# Altium schematic sheet HV_Measurements.SchDoc
size A4; SheetNumber: 3; SheetTotal: 3
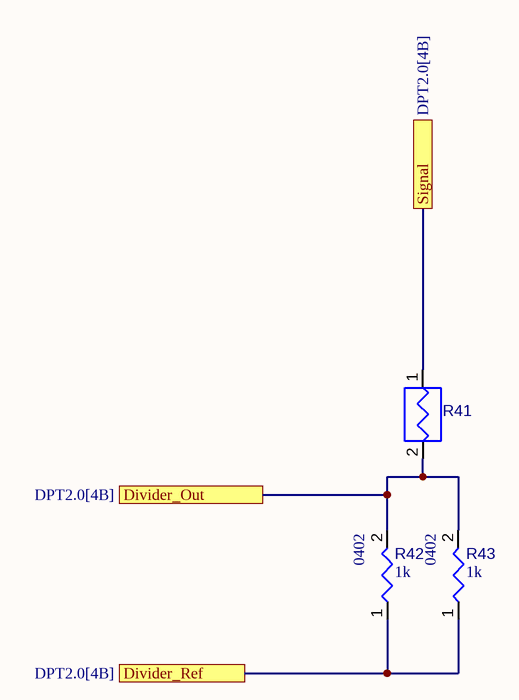
[diagram p0: HV_Measurements.SchDoc]

## Parts
R41  RES-2512-SIDE  [RES_2512_SIDE]  (value not drawn)
R42  value 1k  [RES_0402_HIGH]  (hidden comment: RES-0402)
R43  value 1k  [RES_0402_HIGH]  (hidden comment: RES-0402)

## Ports
Divider_Out (see DPT2.0[4B]), Divider_Ref (see DPT2.0[4B]), Signal (see DPT2.0[4B])

## Nets
Divider_Out: R41.2 R42.2 R43.2 ; port Divider_Out
Divider_Ref: R42.1 R43.1 ; port Divider_Ref
Signal: R41.1 ; port Signal

## Library data of the parts
R41 = CMP-009-00183-1: SMD Resistor - 2512 (6432) On It's Side; Package: 2512
R42 R43 = CMP-009-00177-2: SMD Resistor - 0402 (1005 Metric); Package: 0402